# Altium schematic sheet Sheet5.SchDoc
size A
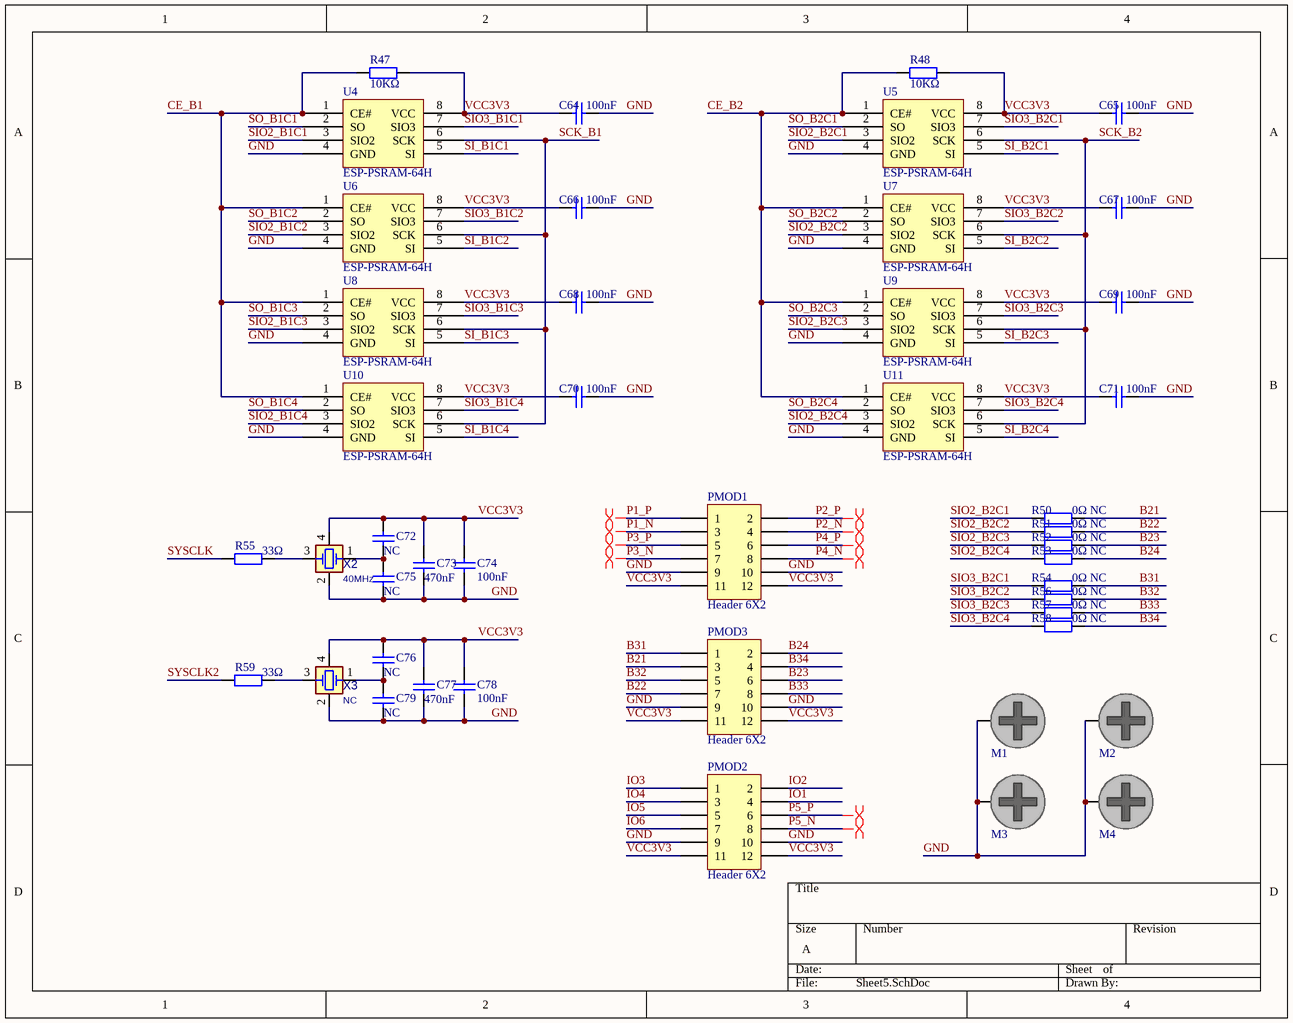
[diagram p0: Sheet5.SchDoc]

## Parts
C64  100nF  [1206_C]
C65  100nF  [1206_C]
C66  100nF  [1206_C]
C67  100nF  [1206_C]
C68  100nF  [1206_C]
C69  100nF  [1206_C]
C70  100nF  [1206_C]
C71  100nF  [1206_C]
C72  NC  [0402_C]
C73  470nF  [0402_C]
C74  100nF  [1206_C]
C75  NC  [0402_C]
C76  NC  [0402_C]
C77  470nF  [0402_C]
C78  100nF  [1206_C]
C79  NC  [0402_C]
M1  DNP/MH  [SCMH_M2]  (value not drawn)  (no BOM)
M2  DNP/MH  [SCMH_M2]  (value not drawn)  (no BOM)
M3  DNP/MH  [SCMH_M2]  (value not drawn)  (no BOM)
M4  DNP/MH  [SCMH_M2]  (value not drawn)  (no BOM)
PMOD1  Header 6X2  [HDR2X6]
PMOD2  Header 6X2  [HDR2X6]
PMOD3  Header 6X2  [HDR2X6]
R47  10KΩ  [1206_R]
R48  10KΩ  [1206_R]
R50  0Ω NC  [0603_R]
R51  0Ω NC  [0603_R]
R52  0Ω NC  [0603_R]
R53  0Ω NC  [0603_R]
R54  0Ω NC  [0603_R]
R55  33Ω  [0603_R]
R56  0Ω NC  [0603_R]
R57  0Ω NC  [0603_R]
R58  0Ω NC  [0603_R]
R59  33Ω  [0603_R]
U4  ESP-PSRAM-64H  [SOIC-8_150mil]
U5  ESP-PSRAM-64H  [SOIC-8_150mil]
U6  ESP-PSRAM-64H  [SOIC-8_150mil]
U7  ESP-PSRAM-64H  [SOIC-8_150mil]
U8  ESP-PSRAM-64H  [SOIC-8_150mil]
U9  ESP-PSRAM-64H  [SOIC-8_150mil]
U10  ESP-PSRAM-64H  [SOIC-8_150mil]
U11  ESP-PSRAM-64H  [SOIC-8_150mil]
X2  40MHz  [XTL_4_3225]
X3  NC  [XTL_4_3225]

## Nets
B21: PMOD3.3 R50.2
B22: PMOD3.7 R51.2
B23: PMOD3.6 R52.2
B24: PMOD3.2 R53.2
B31: PMOD3.1 R54.2
B32: PMOD3.5 R56.2
B33: PMOD3.8 R57.2
B34: PMOD3.4 R58.2
CE_B1: R47.2 U4.1(CE#) U6.1(CE#) U8.1(CE#) U10.1(CE#)
CE_B2: R48.2 U5.1(CE#) U7.1(CE#) U9.1(CE#) U11.1(CE#)
GND: C64.1 C65.1 C66.1 C67.1 C68.1 C69.1 C70.1 C71.1 C73.2 C74.1 C75.2 C77.2 C78.1 C79.2 M1.1 M2.1 M3.1 M4.1 PMOD1.9 PMOD1.10 PMOD2.9 PMOD2.10 PMOD3.9 PMOD3.10 U4.4(GND) U5.4(GND) U6.4(GND) U7.4(GND) U8.4(GND) U9.4(GND) U10.4(GND) U11.4(GND) X2.2(GND1) X3.2(GND1)
IO1: PMOD2.4
IO2: PMOD2.2
IO3: PMOD2.1
IO4: PMOD2.3
IO5: PMOD2.5
IO6: PMOD2.7
P1_N: PMOD1.3
P1_P: PMOD1.1
P2_N: PMOD1.4
P2_P: PMOD1.2
P3_N: PMOD1.7
P3_P: PMOD1.5
P4_N: PMOD1.8
P4_P: PMOD1.6
P5_N: PMOD2.8
P5_P: PMOD2.6
SCK_B1: U4.6(SCK) U6.6(SCK) U8.6(SCK) U10.6(SCK)
SCK_B2: U5.6(SCK) U7.6(SCK) U9.6(SCK) U11.6(SCK)
SI_B1C1: U4.5(SI)
SI_B1C2: U6.5(SI)
SI_B1C3: U8.5(SI)
SI_B1C4: U10.5(SI)
SI_B2C1: U5.5(SI)
SI_B2C2: U7.5(SI)
SI_B2C3: U9.5(SI)
SI_B2C4: U11.5(SI)
SIO2_B1C1: U4.3(SIO2)
SIO2_B1C2: U6.3(SIO2)
SIO2_B1C3: U8.3(SIO2)
SIO2_B1C4: U10.3(SIO2)
SIO2_B2C1: R50.1 U5.3(SIO2)
SIO2_B2C2: R51.1 U7.3(SIO2)
SIO2_B2C3: R52.1 U9.3(SIO2)
SIO2_B2C4: R53.1 U11.3(SIO2)
SIO3_B1C1: U4.7(SIO3)
SIO3_B1C2: U6.7(SIO3)
SIO3_B1C3: U8.7(SIO3)
SIO3_B1C4: U10.7(SIO3)
SIO3_B2C1: R54.1 U5.7(SIO3)
SIO3_B2C2: R56.1 U7.7(SIO3)
SIO3_B2C3: R57.1 U9.7(SIO3)
SIO3_B2C4: R58.1 U11.7(SIO3)
SO_B1C1: U4.2(SO)
SO_B1C2: U6.2(SO)
SO_B1C3: U8.2(SO)
SO_B1C4: U10.2(SO)
SO_B2C1: U5.2(SO)
SO_B2C2: U7.2(SO)
SO_B2C3: U9.2(SO)
SO_B2C4: U11.2(SO)
SYSCLK: R55.1
SYSCLK2: R59.1
VCC3V3: C64.2 C65.2 C66.2 C67.2 C68.2 C69.2 C70.2 C71.2 C72.1 C73.1 C74.2 C76.1 C77.1 C78.2 PMOD1.11 PMOD1.12 PMOD2.11 PMOD2.12 PMOD3.11 PMOD3.12 R47.1 R48.1 U4.8(VCC) U5.8(VCC) U6.8(VCC) U7.8(VCC) U8.8(VCC) U9.8(VCC) U10.8(VCC) U11.8(VCC) X2.4(GND2) X3.4(GND2)
NetC72_2: C72.2 C75.1 X2.1(XA)
NetC76_2: C76.2 C79.1 X3.1(XA)
NetR55_2: R55.2 X2.3(XB)
NetR59_2: R59.2 X3.3(XB)

## Layout directives
differential pair: P1_N, P1_P, P2_N, P2_P, P3_N, P3_P, P4_N, P4_P, P5_N, P5_P

## Library data of the parts
C64-C71 C74 C78 = 1206 100nF (104) 10% 50V: 贴片电容; ComponentLink1Description: 供应商链接; ComponentLink1URL: http://www.szlcsc.com/product/details_25237.html; Package: 1206; Supplier: LC; SuppliersPartNumber: C24497
C72 C73 C75-C77 C79 = 0402 470nF (474) 10% 10V: 贴片电容; ComponentLink1Description: 供应商链接; ComponentLink1URL: http://www.szlcsc.com/product/details_48344.html; Package: 0402; Supplier: LC; SuppliersPartNumber: C47339
M1-M4 = SCMH_M2: SCREW mouting, M2, 2.0mm diameter and 4.0mm PanHead; ASSEMBLY: DNP; VALUE: DNP/MH
PMOD1-PMOD3 = Header 6X2: Header, 6-Pin, Dual row; LatestRevisionDate: 17-Jul-2002; LatestRevisionNote: Re-released for DXP Platform.; Publisher: Altium Limited
R47 R48 = 1206 10KΩ (1002) 1%: 贴片电阻; ComponentLink1Description: 供应商链接; ComponentLink1URL: http://www.szlcsc.com/product/details_18590.html; Package: 1206; Supplier: LC; SuppliersPartNumber: C17902
R50-R54 R56-R58 = 0603 0Ω (0R0) 1%: 贴片电阻; ComponentLink1Description: 供应商链接; ComponentLink1URL: http://www.szlcsc.com/product/details_21903.html; Package: 0603; Supplier: LC; SuppliersPartNumber: C21189
R55 R59 = 0603 33Ω (33R0) 1%: 贴片电阻; ComponentLink1Description: 供应商链接; ComponentLink1URL: http://www.szlcsc.com/product/details_23867.html; Package: 0603; Supplier: LC; SuppliersPartNumber: C23140
U4-U11 = EEPROM/AT24C256C-SSHL-T_[C6482]: PSRAM, 150mil SOP-8; ComponentLink1Description: 供应商链接; ComponentLink1URL: http://www.szlcsc.com/product/details_6947.html; Package: SOIC-8_150mil; Supplier: LC; SuppliersPartNumber: C6482
X2 X3 = XTL_4_40MHz_3225A: CRYSTAL 40.00 MHZ 4pF, 10PPM; MANF: ABRACON; DESC: X1E000021036701; DIST#: MOUSER; MANF_P#: ABM8W-40.0000MHZ-4-B1U-T3; PARAM2: 4pF, 40OhmESR; PARAM: 10PPM, -20~70oC; ASSEMBLY: ASSEMBLY; PRICE: 0.6$
  X2: VALUE: 40MHz
  X3: VALUE: NC